# EAGLE schematic SensorTemperatura (EAGLE 9.6.2)
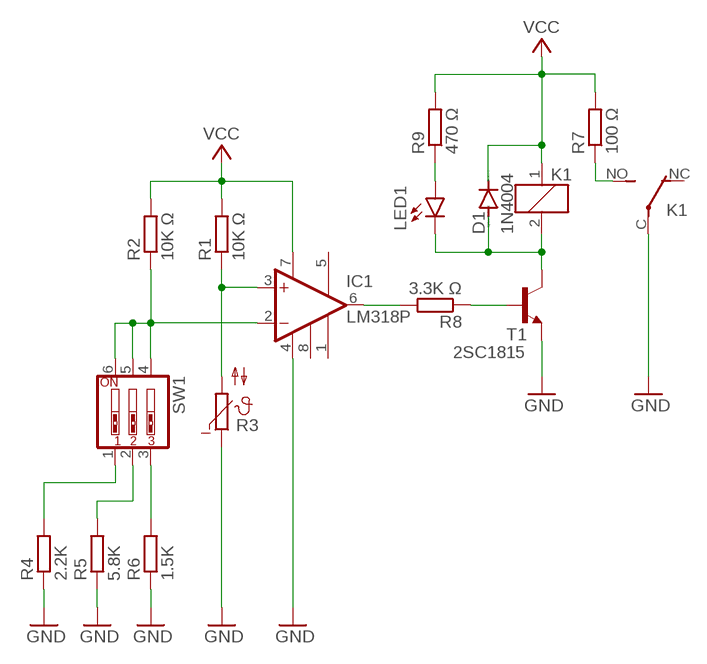
[diagram p0: schematic, sheet 1]

## Parts
D1  1N4004  [DO41-10]
IC1  LM318P  [DIL08]
K1  CQ1-12V  [CQ1]
LED1  TLLR4400  [LED3MM]
R1  10K Ω  R-EU_0207/10  [0207/10]
R2  10K Ω  R-EU_0207/10  [0207/10]
R3  NTC644B  [N644B]
R4  2.2K  R-EU_0207/10  [0207/10]
R5  5.8K  R-EU_0207/10  [0207/10]
R6  1.5K  R-EU_0207/10  [0207/10]
R7  100 Ω  R-EU_0207/10  [0207/10]
R8  3.3K Ω  R-EU_0207/10  [0207/10]
R9  470 Ω  R-EU_0207/10  [0207/10]
SW1  SW_DIP-3  [EDG-03]
T1  2SC1815  [TO92-ECB]

## Nets
GND: K1.C(2:P) R3.1 R4.1 R5.1 R6.1 T1.E
N$1: R6.2 SW1.3
N$2: R5.2 SW1.2
N$3: K1.NO(2:S) R7.1
N$4: R4.2 SW1.1
N$5: IC1.6(OUT) R8.2
N$6: IC1.4(V-) ; supply symbol labelled GND
N$7: IC1.3(+IN) R1.1 R3.2
N$8: IC1.2(-IN) R2.1 SW1.4 SW1.5 SW1.6
N$9: R8.1 T1.B
N$11: D1.A K1.2 LED1.K(C) T1.C
N$12: LED1.A R9.1
VCC: D1.C IC1.7(V+) K1.1 R1.2 R2.2 R7.2 R9.2
Unconnected: IC1.1(BAL1) IC1.5(BAL2) IC1.8(COMP) K1.NC(2:O)

## Library data of the parts
D1 = diode:1N4004: DIODE general purpose rectifier, 1 A
IC1 = linear:LM*18: FAST GENERAL-PURPOSE OPERATIONAL AMPLIFIER Sourde: http://focus.ti.com/lit/ds/slos063b/slos063b.pdf
K1 = relay:CQ1-12V: AUTOMOTIVE QUIET RELAY NAiS Source: http://www.mew-europe.com/.. en_ds_61208_0000.pdf; OC_FARNELL: unknown; OC_NEWARK: unknown
LED1 = led:TLLR4400: Low Current (2mA) LED 3 mm Tinted Diffused Package color RED Source: Data sheet <http://www.farnell.com/datasheets/391100.pdf>; MF: VISHAY SEMICONDUCTOR; OC_FARNELL: 1612437
R1 R2 R4-R9 = rcl:R-EU_: RESISTOR, European symbol; SPICEPREFIX: R
R3 = ptc-ntc:NTC644B: PHILIPS NTC; OC_FARNELL: unknown; OC_NEWARK: unknown
SW1 = special:SW_DIP-3: DIP SWITCH
T1 = transistor:2SC1815: NPN EPITAXIAL TRANSISTOR Source: TOSHIBA .. 2SC1815 1.pdf